# EAGLE design proximity (EAGLE 8.7.0)
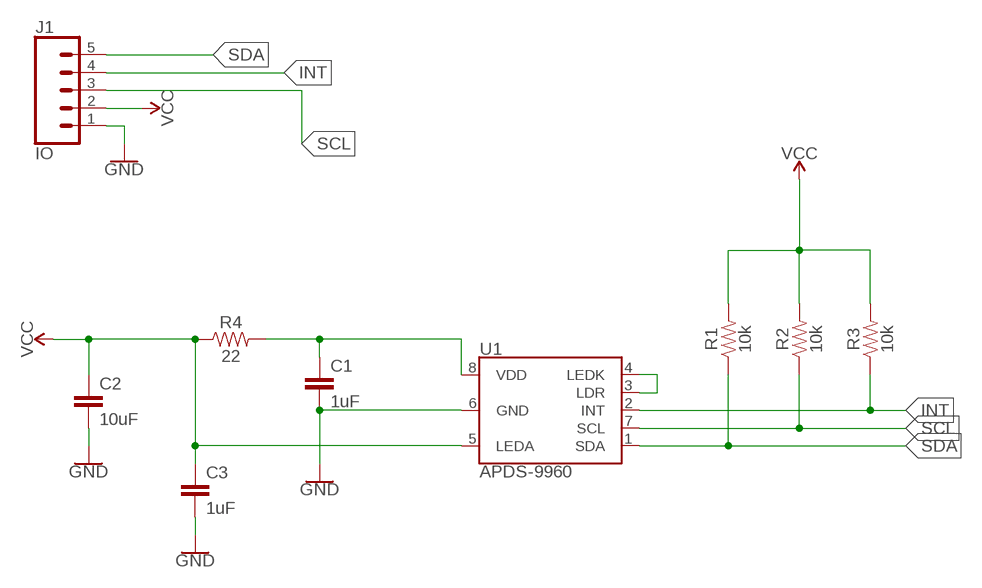
[diagram p0: schematic, sheet 1]

## Parts
C1  1uF  0.1UF-KIT-EZ-50V-20%  [CAP-PTH-SMALL-KIT]
C2  10uF  0.1UF-KIT-EZ-50V-20%  [CAP-PTH-SMALL-KIT]
C3  1uF  0.1UF-KIT-EZ-50V-20%  [CAP-PTH-SMALL-KIT]
J1  IO  CONN_05  [1X05]
R1  10k  10KOHM-HORIZ-1/4W-1%  [AXIAL-0.3]
R2  10k  10KOHM-HORIZ-1/4W-1%  [AXIAL-0.3]
R3  10k  10KOHM-HORIZ-1/4W-1%  [AXIAL-0.3]
R4  22  10KOHM-HORIZ-1/4W-1%  [AXIAL-0.3]
U1  APDS-9960  [APDS-9960]

## Nets
GND: C1.2 C2.2 C3.2 J1.1 U1.6(GND)
INT: J1.4 R3.P$1 U1.2(INT)
N$5: U1.3(LDR) U1.4(LEDK)
N$8: C1.1 R4.P$2 U1.8(VDD)
SCL: J1.3 R2.P$1 U1.7(SCL)
SDA: J1.5 R1.P$1 U1.1(SDA)
VCC: C2.1 C3.1 J1.2 R1.P$2 R2.P$2 R3.P$2 R4.P$1 U1.5(LEDA)

## Library data of the parts
C1-C3 = SparkFun-Capacitors:0.1UF: 0.1µF ceramic capacitors A capacitor is a passive two-terminal electrical component used to store electrical energy temporarily in an electric field.; PROD_ID: CAP-08370; VALUE: 0.1uF
J1 = SparkFun-Connectors:CONN_05: Multi connection point. Often used as Generic Header-pin footprint for 0.1 inch spaced/style header connections On any of the 0.1 inch spaced packages, you can populate with these: Break Away Headers - Straight <https://www.sparkfun.com/products/116> (PRT-00116) Break Away Male Headers - Right Angle <https://www.sparkfun.com/products/553> (PRT-00553) Female Headers <https://www.sparkfun.com/products/115> (PRT-00115) Break Away Headers - Machine Pin <https://www.sparkfun.com/products/117> (PRT-00117) Break Away Female Headers - Swiss Machine Pin <https://www.sparkfun.com/products/743> (PRT-00743) For SCREWTERMINALS and SPRING TERMINALS visit here: Screw Terimnals on SparkFun.com <https://www.sparkfun.com/search/results?term=Screw+Terminals> (5mm/3.5mm/2.54mm spacing) This device is also useful as a general connection point to wire up your design to another part of your project. Our various solder wires solder well into these plated through hole pads. Hook-Up Wire - Assortment (Stranded, 22 AWG) <https://www.sparkfun.com/products/11375> (PRT-11375) Hook-Up Wire - Assortment (Solid Core, 22 AWG) <https://www.sparkfun.com/products/11367> (PRT-11367) View the entire wire category on our website here <https://www.sparkfun.com/categories/141> Special notes: Molex polarized connector foot print use with SKU : PRT-08231 with associated crimp pins and housings. 1MM SMD Version SKU: PRT-10208
R1-R3 = SparkFun-Resistors:10KOHM: 10kΩ resistor A resistor is a passive two-terminal electrical component that implements electrical resistance as a circuit element. Resistors act to reduce current flow, and, at the same time, act to lower voltage levels within circuits. - Wikipedia; PROD_ID: RES-12183
R4 = SparkFun-Resistors:10KOHM: 10kΩ resistor A resistor is a passive two-terminal electrical component that implements electrical resistance as a circuit element. Resistors act to reduce current flow, and, at the same time, act to lower voltage levels within circuits. - Wikipedia; PROD_ID: RES-12183; VALUE: 10k
U1 = SparkFun-Sensors2:APDS-9960: Avago APDS-9960 Digital Proximity, Ambient Light, RGB, and Gesture Sensor. The APDS-9960 offers ambient light and color measuring, proximity detection, and touchless gesture sensing. It features UV and IR blocking filters, four separate diodes sensitive to different directions, and an I2C compatible interface. Datasheet <https://cdn.sparkfun.com/datasheets/Sensors/Proximity/apds9960.pdf> SparkFun Products SparkFun RGB and Gesture Sensor - APDS-9960 <https://www.sparkfun.com/products/12787> (SEN-12787); PROD_ID: SEN-12005

## Board
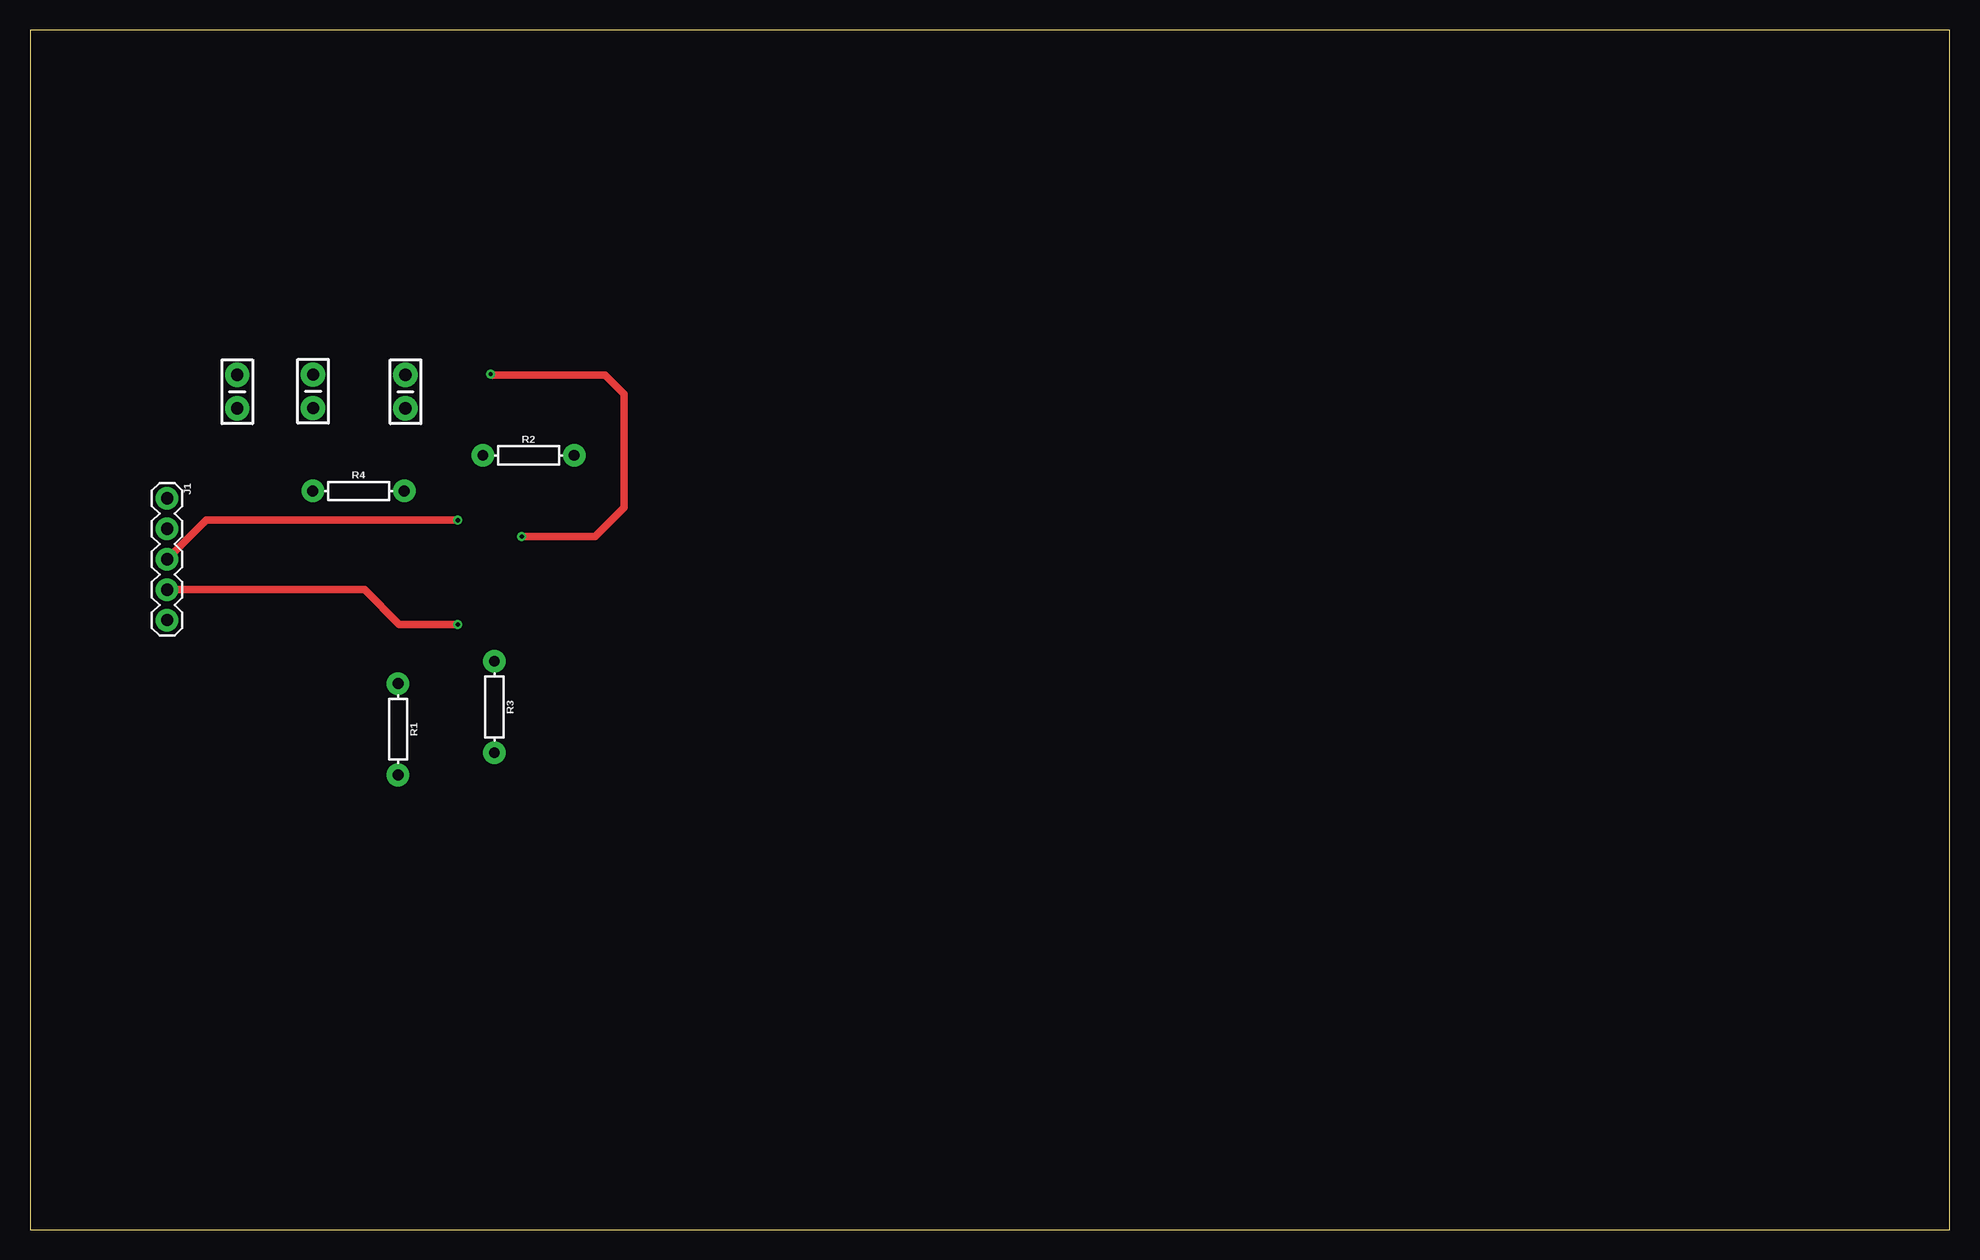
[diagram p1: board, top side]
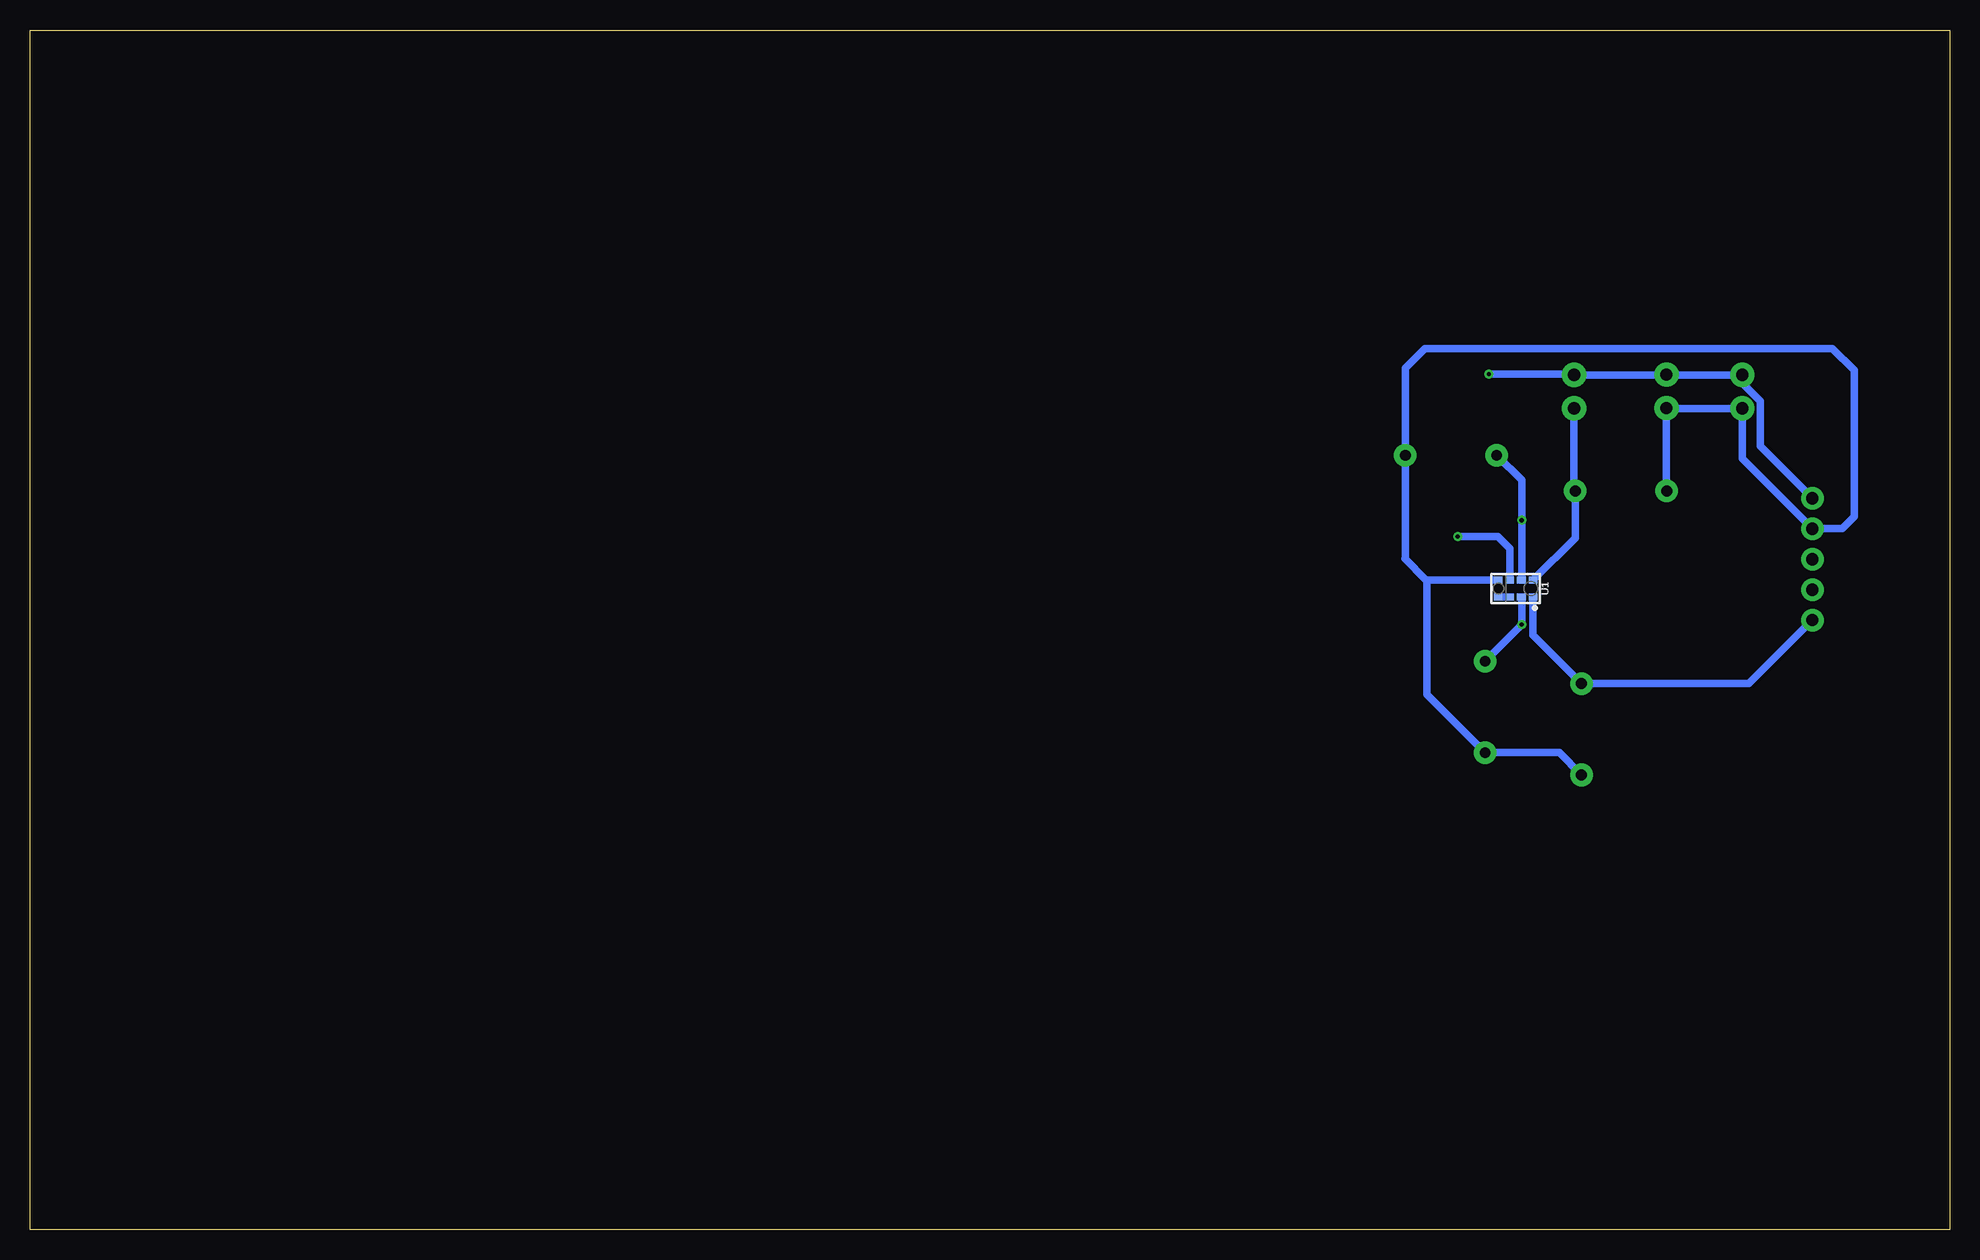
[diagram p2: board, bottom side, seen from below]

Size 160 x 100 mm. Coordinates in mm from the lower left corner, seen from the top.
Outline: 0,0 160,0 160,100 0,100 0,0
Copper layers (1*16): Top 0.035mm / dielectric 1.5mm / Bottom 0.035mm
Design rules "default *": minimum track width 25mil, minimum drill 0.35mm, track to track 6mil, track to pad 6mil, pad to pad 6mil, via to via 6mil, smd to smd 6mil, copper to edge 100mil, drill to drill 6mil, minimum pad ring 10mil, minimum via ring 8mil, stop-mask expansion 4mil, vias tented up to drill 0mil, thermal gap 10mil

### Footprints (pad centres in the part's own frame; a part is rotated, then mirrored left to right if it is on the bottom)
CAP-PTH-SMALL-KIT = drill 1.016 pad 2.032: 1 -1.397,0; 2 1.397,0
1X05 = drill 1.016 pad 1.88: 1 0,0; 2 2.54,0; 3 5.08,0; 4 7.62,0; 5 10.16,0
AXIAL-0.3 = drill 0.9 pad 1.88: P$1 -3.81,0; P$2 3.81,0
APDS-9960 = smd 0.6 x 0.72: 1 0.7,1.455; 2 0.7,0.485; 3 0.7,-0.485; 4 0.7,-1.455; 5 -0.7,-1.455; 6 -0.7,-0.485; 7 -0.7,0.485; 8 -0.7,1.455

### Placement (x,y rotation side)
C1  31.29,69.85 90 top
C2  17.27,69.85 90 top
C3  23.6,69.88 90 top
J1  11.43,60.96 270 top
R1  30.68,41.71 270 top
R2  41.55,64.54 0 top
R3  38.71,43.56 270 top
R4  27.38,61.57 0 top
U1  36.17,53.44 270 bottom

### Tracks (layer width: path | path; a pad name or v marks a point on that pad's centre or on a via)
GND  (via drill 0.35)
  Top 0.635: v41,57.76 47.09,57.76 49.53,60.2 49.53,69.65 47.93,71.25 38.48,71.25 v38.41,71.32
  Bottom 0.635: J1.1 15.79,65.32 15.79,69.07 17.27,70.55 C2.2 23.57,71.25 C3.2 23.62,71.25 C1.2 31.37,71.32 v38.41,71.32 | U1.6 36.66,56.77 37.64,57.76 v41,57.76
INT  (via drill 0.35)
  Top 0.635: J1.4 27.89,53.34 30.79,50.44 v35.66,50.44
  Bottom 0.635: R3.P$1 35.66,50.42 v35.66,50.44 35.66,52.72 U1.2
N$5
  Bottom 0.635: U1.3 U1.4
N$8
  Bottom 0.635: C1.1 31.29,61.67 R4.P$2 31.19,57.66 U1.8
SCL  (via drill 0.35)
  Top 0.635: v35.66,59.13 14.68,59.13 J1.3
  Bottom 0.635: U1.7 35.66,54.16 v35.66,59.13 35.66,62.46 R2.P$1
SDA
  Bottom 0.635: U1.1 34.72,49.55 R1.P$1 16.71,45.52 J1.5
VCC
  Bottom 0.635: U1.5 43.55,54.14 | 43.55,54.14 43.59,54.1 | 43.55,54.14 43.63,54.14 45.41,55.93 45.36,55.98 R2.P$2 45.36,71.83 43.74,73.46 9.75,73.46 7.92,71.63 7.92,59.44 8.94,58.42 J1.2 17.27,64.26 C2.1 23.57,68.45 C3.1 23.6,61.59 R4.P$1 | 43.55,54.14 43.55,44.59 R3.P$2 32.54,39.75 R1.P$2